# Altium schematic sheet POS.SchDoc
size A4; SheetNumber: 8; SheetTotal: 12
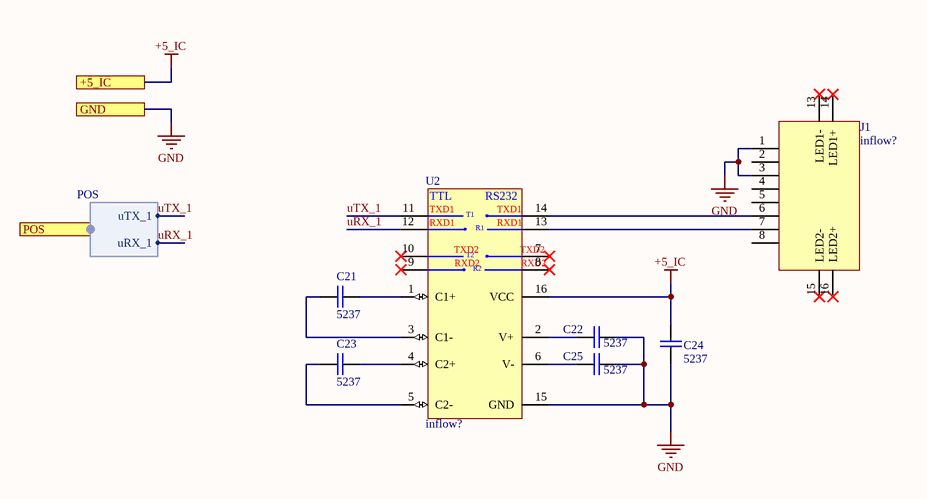
[diagram p0: POS.SchDoc]

## Parts
C21  Inflow: 5237  [CAP 1206/3216]  (hidden comment: 1u'F, 50'V)
C22  Inflow: 5237  [CAP 1206/3216]  (hidden comment: 1u'F, 50'V)
C23  Inflow: 5237  [CAP 1206/3216]  (hidden comment: 1u'F, 50'V)
C24  Inflow: 5237  [CAP 1206/3216]  (hidden comment: 1u'F, 50'V)
C25  Inflow: 5237  [CAP 1206/3216]  (hidden comment: 1u'F, 50'V)
J1  Inflow: inflow?  [RJ45_MINI]  (hidden comment: RJ45, mini)
U2  Inflow: inflow?  [NSO16_M]  (hidden comment: MAX3232)

## Ports
+5_IC, GND, POS (harness POS)

## Harnesses
POS: uTX_1, uRX_1

## Nets
+5_IC: C24.1 U2.16(VCC) ; port +5_IC
GND: C22.2 C24.2 C25.2 J1.1 J1.3 U2.15(GND) ; port GND
uRX_1: U2.12(R1OUT) ; port POS.uRX_1
uTX_1: U2.11(T1IN) ; port POS.uTX_1
NetC21_1: C21.1 U2.1(C1+)
NetC21_2: C21.2 U2.3(C1-)
NetC22_1: C22.1 U2.2(V+)
NetC23_1: C23.1 U2.4(C2+)
NetC23_2: C23.2 U2.5(C2-)
NetC25_1: C25.1 U2.6(V-)
NetJ1_6: J1.6 U2.14(T1OUT)
NetJ1_7: J1.7 U2.13(R1IN)

Not connected (* = marked no-connect by the designer): J1 2 4 5 8 13(LED1-)* 14(LED1+)* 15(LED2-)* 16(LED2+)*; U2 7(T2OUT)* 8(R2IN)* 9(R2OUT)* 10(T2IN)*

## Notes on the sheet
- (in symbol IC_Converter_MAX3232CSE) TTL; TXD1; T1; RXD1; R1; TXD2; T2; RXD2; R2

## Library data of the parts
C21-C25 = Cap_Multi_1u_50_1206: Bipolar ceramic capacitor SMD; Rating: Rating?; Type: Type?; Validation: Valid; Value: 1u'F, 50'V; Package: Package?
J1 = Con_PC_RJ45_MINI: RJ45 Mini With two LEDs; Rating: Rating?; Validation: NT; Value: RJ45, mini; Package: Package?; Type: Type?
U2 = IC_Converter_MAX3232CSE: RS-232 Interface IC 3.0V to 5.5V, Low-Power, up to 1Mbps, True RS-232 Transceivers Using Four 0.1uF External Capacitors; Rating: Rating?; Validation: Valid; Value: MAX3232; Package: SOIC-16; Type: RS232